# Altium schematic sheet Mcu.SchDoc
size A4
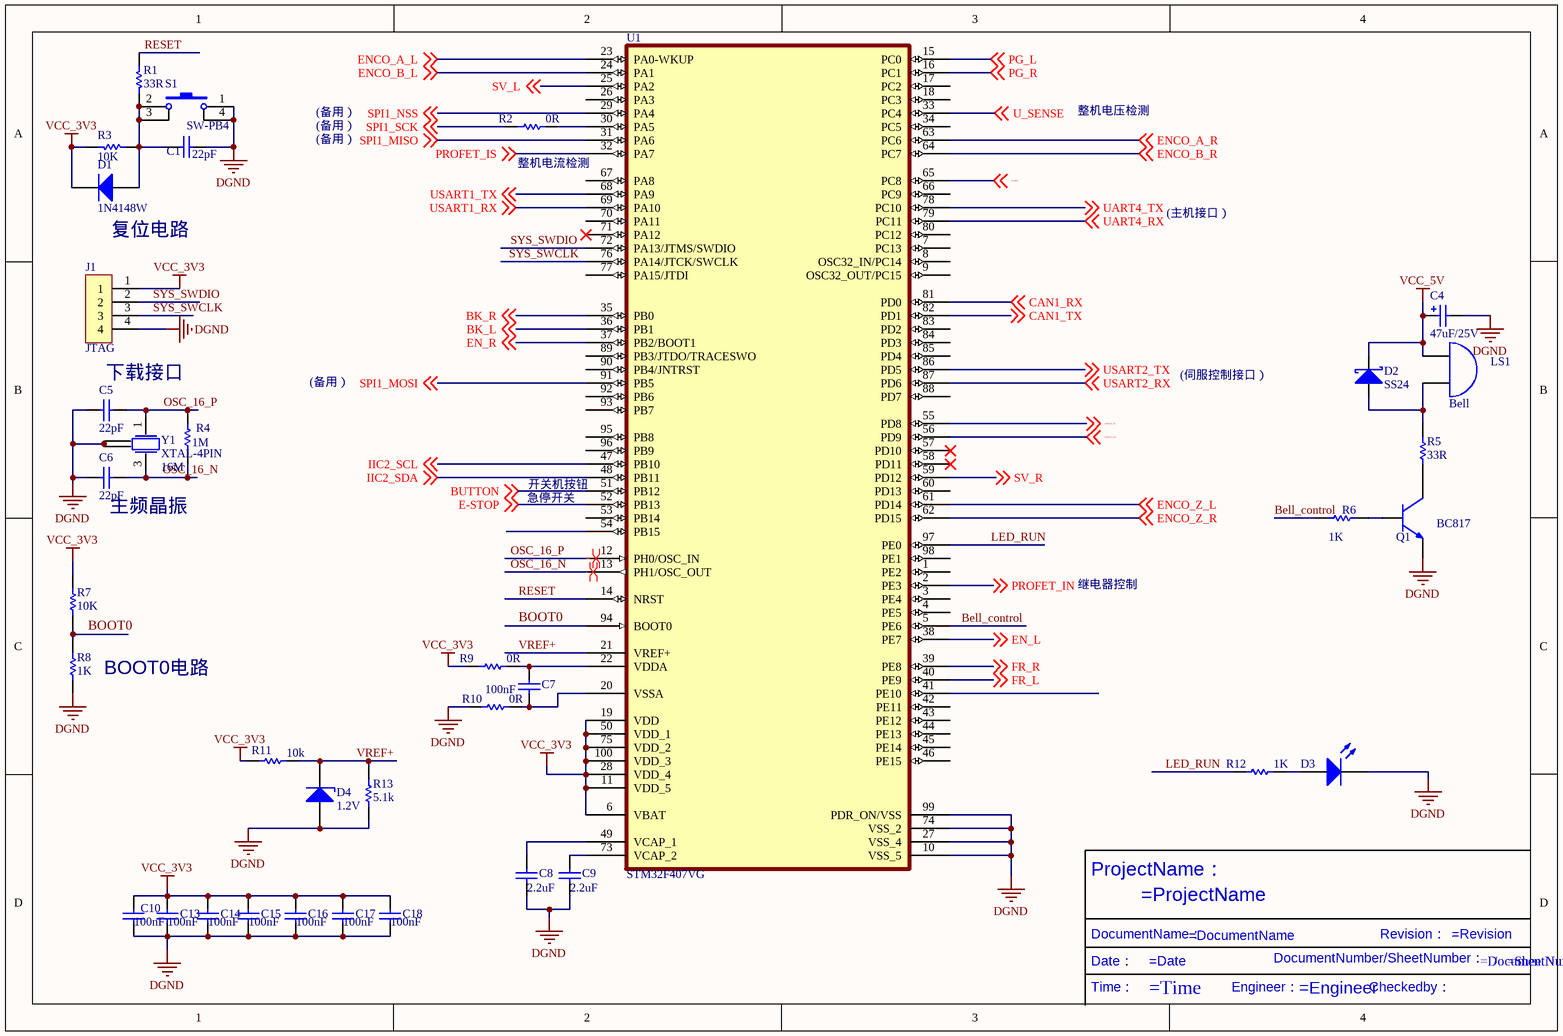
[diagram p0: Mcu.SchDoc]

## Parts
C1  value 22pF  [C0805]  (hidden comment: Cap)
C4  value 47uF/25V  [CAP-1206]  (hidden comment: Cap Pol1)
C5  value 22pF  [C0805]  (hidden comment: Cap)
C6  value 22pF  [C0805]  (hidden comment: Cap)
C7  value 100nF  [C0805]  (hidden comment: Cap)
C8  value 2.2uF  [C0805]  (hidden comment: Cap)
C9  value 2.2uF  [C0805]  (hidden comment: Cap)
C10  value 100nF  [C0805]  (hidden comment: Cap)
C13  value 100nF  [C0805]  (hidden comment: Cap)
C14  value 100nF  [C0805]  (hidden comment: Cap)
C15  value 100nF  [C0805]  (hidden comment: Cap)
C16  value 100nF  [C0805]  (hidden comment: Cap)
C17  value 100nF  [C0805]  (hidden comment: Cap)
C18  value 100nF  [C0805]  (hidden comment: Cap)
D1  value 1N4148W  [DIODE-1206]  (hidden comment: Diode)
D2  value SS24  [DIODE-SMA]  (hidden comment: Diode-Schottky)
D3  LED0  [LED_0805]  (value not drawn)
D4  value 1.2V  [DIODE-1206]  (hidden comment: Diode-Z)
J1  JTAG  [PORT-SIP4-2.54]
LS1  Bell  [PIN2]
Q1  BC817  [SOT-23_N]
R1  value 33R  [R0805]  (hidden comment: Res1)
R2  value 0R  [R0805]  (hidden comment: Res1)
R3  value 10K  [R0805]  (hidden comment: Res1)
R4  value 1M  [R0805]  (hidden comment: Res1)
R5  value 33R  [R0805]  (hidden comment: Res1)
R6  value 1K  [R0805]  (hidden comment: Res1)
R7  value 10K  [R0805]  (hidden comment: Res1)
R8  value 1K  [R0805]  (hidden comment: Res1)
R9  value 0R  [R0805]  (hidden comment: Res1)
R10  value 0R  [R0805]  (hidden comment: Res1)
R11  value 10k  [R0805]  (hidden comment: Res1)
R12  value 1K  [R0805]  (hidden comment: Res1)
R13  value 5.1k  [R0805]  (hidden comment: Res1)
S1  SW-PB4  [RESET-SMD-1O4]
U1  STM32F407VG  [100T1_N]
Y1  XTAL-4PIN  value 16M  [EPSON-16M]

## Nets
DGND: C1.1 C4.2 C5.1 C6.2 C8.2 C9.2 C10.2 C13.2 C14.2 C15.2 C16.2 C17.2 C18.2 D3.2(K) D4.1(A) J1.4 Q1.2(E) R8.1 R10.2 R13.1 S1.1 S1.4 U1.10(VSS_5) U1.27(VSS_4) U1.74(VSS_2) U1.99(PDR_ON/VSS) Y1.2 Y1.4
VCC_3V3: C10.1 C13.1 C14.1 C15.1 C16.1 C17.1 C18.1 D1.2(K) J1.1 R3.2 R7.1 R9.2 R11.2 U1.6(VBAT) U1.11(VDD_5) U1.19(VDD) U1.28(VDD_4) U1.50(VDD_1) U1.75(VDD_2) U1.100(VDD_3)
VCC_5V: C4.1 D2.2(K) LS1.1(A)
B-STOP: U1.65(PC8) ; off-sheet B-STOP
Bell_control: R6.2 U1.5(PE6)
BK_L: U1.36(PB1) ; off-sheet BK_L
BK_R: U1.35(PB0) ; off-sheet BK_R
BOOT0: R7.2 R8.2 U1.94(BOOT0)
BUTTON: U1.51(PB12) ; off-sheet BUTTON
CAN1_RX: U1.81(PD0) ; off-sheet CAN1_RX
CAN1_TX: U1.82(PD1) ; off-sheet CAN1_TX
E-STOP: U1.52(PB13) ; off-sheet E-STOP
EN_L: U1.38(PE7) ; off-sheet EN_L
EN_R: U1.37(PB2/BOOT1) ; off-sheet EN_R
ENCO_A_L: U1.23(PA0-WKUP) ; off-sheet ENCO_A_L
ENCO_A_R: U1.63(PC6) ; off-sheet ENCO_A_R
ENCO_B_L: U1.24(PA1) ; off-sheet ENCO_B_L
ENCO_B_R: U1.64(PC7) ; off-sheet ENCO_B_R
ENCO_Z_L: U1.61(PD14) ; off-sheet ENCO_Z_L
ENCO_Z_R: U1.62(PD15) ; off-sheet ENCO_Z_R
FR_L: U1.40(PE9) ; off-sheet FR_L
FR_R: U1.39(PE8) ; off-sheet FR_R
IIC2_SCL: U1.47(PB10) ; off-sheet IIC2_SCL
IIC2_SDA: U1.48(PB11) ; off-sheet IIC2_SDA
LED_RUN: R12.2 U1.97(PE0)
OSC_16_N: C6.1 R4.1 U1.13(PH1/OSC_OUT) Y1.3
OSC_16_P: C5.2 R4.2 U1.12(PH0/OSC_IN) Y1.1
PG_L: U1.15(PC0) ; off-sheet PG_L
PG_R: U1.16(PC1) ; off-sheet PG_R
PROFET_IN: U1.2(PE3) ; off-sheet PROFET_IN
PROFET_IS: U1.32(PA7) ; off-sheet PROFET_IS
RESET: R1.1 U1.14(NRST)
SPI1_MISO: U1.31(PA6) ; off-sheet SPI1_MISO
SPI1_MOSI: U1.91(PB5) ; off-sheet SPI1_MOSI
SPI1_NSS: U1.29(PA4) ; off-sheet SPI1_NSS
SPI1_SCK: R2.2 ; off-sheet SPI1_SCK
SV_L: U1.25(PA2) ; off-sheet SV_L
SV_R: U1.59(PD12) ; off-sheet SV_R
SYS_SWCLK: J1.3 U1.76(PA14/JTCK/SWCLK)
SYS_SWDIO: J1.2 U1.72(PA13/JTMS/SWDIO)
U_SENSE: U1.33(PC4) ; off-sheet U_SENSE
UART4_RX: U1.79(PC11) ; off-sheet UART4_RX
UART4_TX: U1.78(PC10) ; off-sheet UART4_TX
USART1_RX: U1.69(PA10) ; off-sheet USART1_RX
USART1_TX: U1.68(PA9) ; off-sheet USART1_TX
USART2_RX: U1.87(PD6) ; off-sheet USART2_RX
USART2_TX: U1.86(PD5) ; off-sheet USART2_TX
USART3_RX: U1.56(PD9) ; off-sheet USART3_RX
USART3_TX: U1.55(PD8) ; off-sheet USART3_TX
VREF+: D4.2(K) R11.1 R13.2 U1.21(VREF+)
NetC1_2: C1.2 D1.1(A) R1.2 R3.1 S1.2 S1.3
NetC7_1: C7.1 R10.1 U1.20(VSSA)
NetC7_2: C7.2 R9.1 U1.22(VDDA)
NetC8_1: C8.1 U1.49(VCAP_1)
NetC9_1: C9.1 U1.73(VCAP_2)
NetD2_1: D2.1(A) LS1.2(B) R5.1
NetD3_1: D3.1(A) R12.1
NetQ1_1: Q1.1(B) R6.1
NetQ1_3: Q1.3(C) R5.2
NetR2_1: R2.1 U1.30(PA5)

Not connected (* = marked no-connect by the designer): U1 1(PE2) 3(PE4) 4(PE5) 7(PC13) 8(OSC32_IN/PC14) 9(OSC32_OUT/PC15) 17(PC2) 18(PC3) 26(PA3) 34(PC5) 41(PE10) 42(PE11) 43(PE12) 44(PE13) 45(PE14) 46(PE15) 53(PB14) 54(PB15) 57(PD10)* 58(PD11)* 60(PD13) 66(PC9) 67(PA8) 70(PA11) 71(PA12)* 77(PA15/JTDI) 80(PC12) 83(PD2) 84(PD3) 85(PD4) 88(PD7) 89(PB3/JTDO/TRACESWO) 90(PB4/JNTRST) 92(PB6) 93(PB7) 95(PB8) 96(PB9) 98(PE1)

## Layout directives
differential pair: OSC_16_N, OSC_16_P

## Notes on the sheet
- (备用）
- 整机电压检测
- (near R2) 整机电流检测
- 复位电路
- (主机接口）
- 下载接口
- (伺服控制接口）
- (near C6) 主频晶振
- 急停开关
- 开关机按钮
- 继电器控制
- (near R8) BOOT0电路
- Labels drawn without touching a wire or pin: /, =Date, =DocumentName, =DocumentNumber, =Engineer, =ProjectName, =Revision, =SheetNumber, =Time, Checkedby：, Date：, DocumentName：, DocumentNumber/SheetNumber：, Engineer：, ProjectName：, Revision：, Time：

## Library data of the parts
C1 C5-C10 C13-C18 = Cap: Capacitor; Published: 8-Jun-2000; LatestRevisionDate: 17-Jul-2002; LatestRevisionNote: Re-released for DXP Platform.; PackageReference: RAD-0.3; Publisher: Altium Limited; PackageDescription: Radial Cap, Thru-Hole; 2 Leads; 0.3 in Pin Spacing
C4 = Cap Pol1: Polarized Capacitor (Radial); Published: 8-Jun-2000; LatestRevisionDate: 17-Jul-2002; LatestRevisionNote: Re-released for DXP Platform.; PackageReference: RB7.6-15; Publisher: Altium Limited; PackageDescription: Polarized Capacitor (Radial); 2 Leads
D1 = Diode: 二极管; Type: S01575; Published: 8-Jun-2000; LatestRevisionDate: 17-Jul-2002; LatestRevisionNote: Re-released for DXP Platform.; PackageDocument: Sep-1996; PackageReference: CD1206; Publisher: Altium Limited; Code_JEDEC: DO-214-AB
D2 = Diode-Schottky: 肖特基二极管; Published: 8-Jun-2000; LatestRevisionDate: 17-Jul-2002; LatestRevisionNote: Re-released for DXP Platform.; PackageReference: SMB; Publisher: Altium Limited; Code_JEDEC: DO-214-AA
D3 = LED0: 发光二极管; Published: 8-Jun-2000; LatestRevisionDate: 08-Jul-2005; LatestRevisionNote: Mech Layer 1 removed.; PackageReference: LED-0; Publisher: Altium Limited
D4 = Diode-Z: 稳压二极管; Published: 8-Jun-2000; LatestRevisionDate: 17-Jul-2002; LatestRevisionNote: Re-released for DXP Platform.; PackageReference: SMB; Publisher: Altium Limited; Code_JEDEC: DO-214-AA
J1 = Conn_1*4_1
LS1 = Bell: Electrical Bell; Published: 24-Mar-1999; LatestRevisionDate: 17-Jul-2002; LatestRevisionNote: Re-released for DXP Platform.; PackageReference: PIN2; Publisher: Altium Limited
Q1 = mNPN: NPN 45V 功耗 310mW; Value: BC817
R1-R13 = Res1: Resistor; Published: 8-Jun-2000; LatestRevisionDate: 17-Jul-2002; LatestRevisionNote: Re-released for DXP Platform.; PackageReference: AXIAL-0.3; Publisher: Altium Limited; PackageDescription: Axial Device, Thru-Hole; 2 Leads; 0.3 in Pin Spacing
S1 = SW-PB4: 微动开关; Published: 24-Mar-1999; LatestRevisionDate: 17-Jul-2002; LatestRevisionNote: Re-released for DXP Platform.; PackageReference: SPST-2; Publisher: Altium Limited